# EAGLE schematic tx (EAGLE 9.6.2)
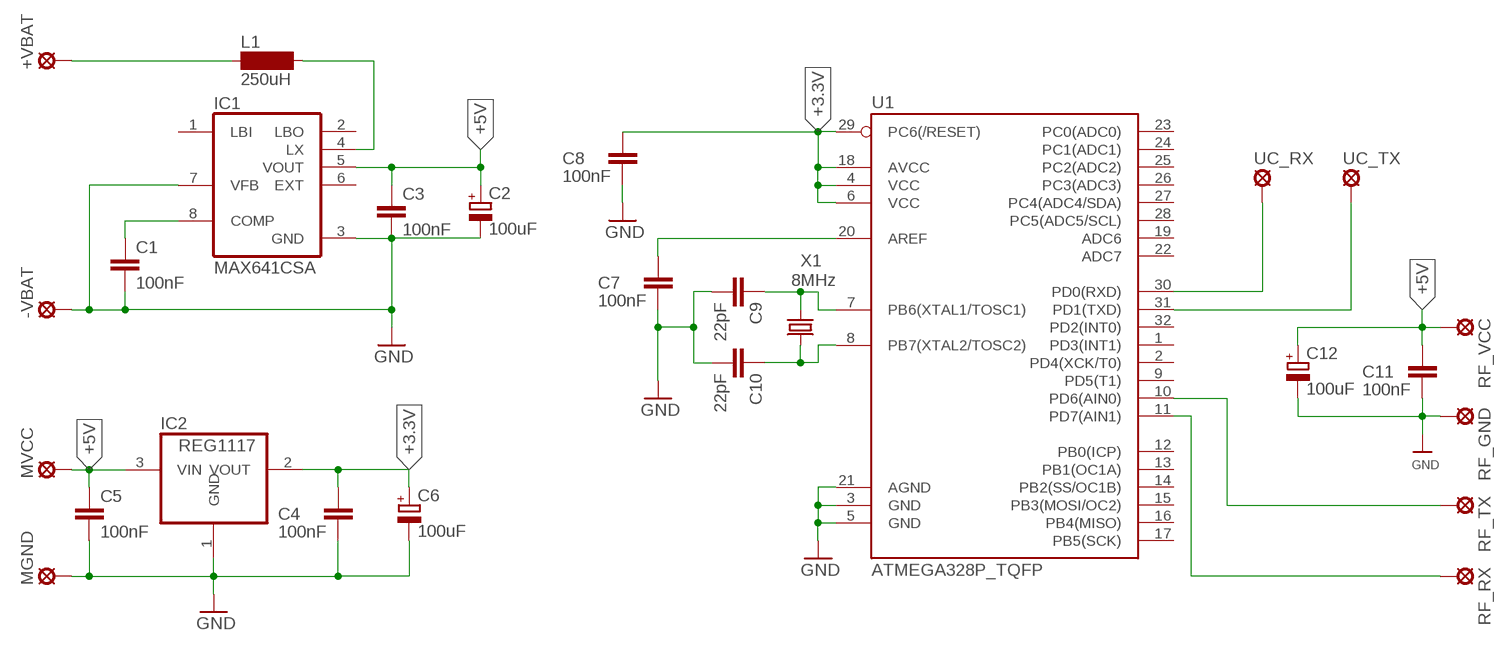
[diagram p0: schematic, sheet 1]

## Parts
+VBAT  SE14  [SE14]
-VBAT  SE14  [SE14]
C1  100nF  C-EUC1206  [C1206]
C2  100uF  CPOL-EU140CLH-0810  [140CLH-0810]
C3  100nF  C-EUC1206  [C1206]
C4  100nF  C-EUC1206  [C1206]
C5  100nF  C-EUC1206  [C1206]
C6  100uF  CPOL-EU140CLH-0810  [140CLH-0810]
C7  100nF  C-EUC1206  [C1206]
C8  100nF  C-EUC1206  [C1206]
C9  22pF  22PF-0603-50V-5%  [0603]
C10  22pF  22PF-0603-50V-5%  [0603]
C11  100nF  C-EUC1206  [C1206]
C12  100uF  CPOL-EU140CLH-0810  [140CLH-0810]
IC1  MAX641CSA  [SO08]
IC2  REG1117  [SOT223]
L1  250uH  MS50  [MS50]
MGND  SE14  [SE14]
MVCC  SE14  [SE14]
RF_GND  SE14  [SE14]
RF_RX  SE14  [SE14]
RF_TX  SE14  [SE14]
RF_VCC  SE14  [SE14]
U1  ATMEGA328P_TQFP  [TQFP32-08]
UC_RX  SE14  [SE14]
UC_TX  SE14  [SE14]
X1  8MHz  CSM-7X-DU  [CSM-7X-DU]

## Nets
+3.3V: C4.1 C6.+ C8.1 IC2.2(VOUT) U1.4(VCC) U1.6(VCC) U1.18(AVCC) U1.29(PC6(/RESET))
+5V: C2.+ C3.1 C5.1 C11.1 C12.+ IC1.5(VOUT) IC2.3(VIN) MVCC.MP RF_VCC.MP
GND: -VBAT.MP C1.2 C2.- C3.2 C4.2 C5.2 C6.- C7.2 C8.2 C9.2 C10.2 C11.2 C12.- IC1.3(GND) IC1.7(VFB) IC2.1(GND) MGND.MP RF_GND.MP U1.3(GND) U1.5(GND) U1.21(AGND)
N$1: IC1.4(LX) L1.2
N$2: C1.1 IC1.8(COMP)
N$3: C7.1 U1.20(AREF)
N$4: +VBAT.MP L1.1
N$5: RF_RX.MP U1.11(PD7(AIN1))
N$6: C9.1 U1.7(PB6(XTAL1/TOSC1)) X1.1
N$7: C10.1 U1.8(PB7(XTAL2/TOSC2)) X1.2
N$8: RF_TX.MP U1.10(PD6(AIN0))
N$9: U1.30(PD0(RXD)) UC_RX.MP
N$10: U1.31(PD1(TXD)) UC_TX.MP
Unconnected: IC1.1(LBI) IC1.2(LBO) IC1.6(EXT) U1.1(PD3(INT1)) U1.2(PD4(XCK/T0)) U1.9(PD5(T1)) U1.12(PB0(ICP)) U1.13(PB1(OC1A)) U1.14(PB2(SS/OC1B)) U1.15(PB3(MOSI/OC2)) U1.16(PB4(MISO)) U1.17(PB5(SCK)) U1.19(ADC6) U1.22(ADC7) U1.23(PC0(ADC0)) U1.24(PC1(ADC1)) U1.25(PC2(ADC2)) U1.26(PC3(ADC3)) U1.27(PC4(ADC4/SDA)) U1.28(PC5(ADC5/SCL)) U1.32(PD2(INT0))

## Library data of the parts
+VBAT -VBAT MGND MVCC RF_GND RF_RX RF_TX RF_VCC UC_RX UC_TX = solpad:SE14: SOLDER PAD E1553, drill 1,4mm, distributor Buerklin, 07F820
C1 C3-C5 C7 C8 C11 = rcl:C-EU: CAPACITOR, European symbol; SPICEPREFIX: C
C2 C6 C12 = rcl:CPOL-EU: POLARIZED CAPACITOR, European symbol; SPICEPREFIX: C
C9 C10 = SparkFun-Capacitors:22PF: 22pF ceramic capacitors A capacitor is a passive two-terminal electrical component used to store electrical energy temporarily in an electric field.; PROD_ID: CAP-07876
IC1 = maxim:MAX641CSA: Step-up SWITCHING REGULATOR CONTROLLER; OC_FARNELL: unknown; OC_NEWARK: unknown
IC2 = burr-brown:REG1117: 800mA and 1A Low Dropout (LDO) Positive Regulator 1.8V, 2.5V, 2.85V, 3.3V, 5V, and Adj; MPN: REG1117; OC_FARNELL: 1097566; OC_NEWARK: 14P6981
L1 = inductor-neosid:MS50: INDUCTOR SMD power inductor; OC_FARNELL: unknown; OC_NEWARK: unknown
U1 = SparkFun-IC-Microcontroller:ATMEGA328P_TQFP: Popular 328P in QFP Storefront component: ATmega328 - TQFP <https://www.sparkfun.com/products/13448> (COM-13448) Datasheet <http://www.sparkfun.com/datasheets/Components/SMD/ATMega328.pdf> SparkFun Products SparkFun RedBoard - Programmed with Arduino <https://www.sparkfun.com/products/12757> (DEV-12757) Arduino Pro Mini 328 - 5V/16MHz <https://www.sparkfun.com/products/11113> (DEV-11113) Arduino Pro Mini 328 - 3.3V/8MHz <https://www.sparkfun.com/products/11114> (DEV-11114) SparkFun OpenLog <https://www.sparkfun.com/products/13712> (DEV-13712) SparkFun MicroView - OLED Arduino Module <https://www.sparkfun.com/products/12923> (DEV-12923) SparkFun Digital Sandbox <https://www.sparkfun.com/products/12651> (DEV-12651) SparkFun PicoBoard <https://www.sparkfun.com/products/11888> (WIG-11888) Arduino Fio <https://www.sparkfun.com/products/10116> (DEV-10116) LilyPad Arduino 328 Main Board <https://www.sparkfun.com/products/13342> (DEV-13342) SparkFun RedStick <https://www.sparkfun.com/products/13741> (DEV-13741) LilyPad MP3 <https://www.sparkfun.com/products/11013> (DEV-11013) LilyPad Arduino SimpleSnap <https://www.sparkfun.com/products/10941> (DEV-10941) SparkFun Stepoko <https://www.sparkfun.com/products/13899> (ROB-13899) SparkFun Geiger Counter <https://www.sparkfun.com/products/11345> (SEN-11345) SparkFun EL Sequencer <https://www.sparkfun.com/products/12781> (COM-12781) Arduino Pro 328 - 5V/16MHz <https://www.sparkfun.com/products/10915> (DEV-10915) CryptoCape <https://www.sparkfun.com/products/12773> (DEV-12773) SparkFun IR Thermometer Evaluation Board - MLX90614 <https://www.sparkfun.com/products/10740> (SEN-10740) SparkFun RedBot Mainboard <https://www.sparkfun.com/products/12097> (ROB-12097) Arduino Pro 328 - 3.3V/8MHz <https://www.sparkfun.com/products/10914> (DEV-10914) SparkFun Block for Intel® Edison - Arduino <https://www.sparkfun.com/products/13036> (DEV-13036) SparkFun Simon Says - Surface Mount Soldering Kit <https://www.sparkfun.com/products/10935> (KIT-10935) SparkFun 7-Segment Serial Display - Red <https://www.sparkfun.com/products/11441> (COM-11441) SparkFun 7-Segment Serial Display - White <https://www.sparkfun.com/products/11629> (COM-11629) SparkFun 7-Segment Serial Display - Yellow <https://www.sparkfun.com/products/11443> (COM-11443) SparkFun 7-Segment Serial Display - Kelly Green <https://www.sparkfun.com/products/11440> (COM-11440) SparkFun 7-Segment Serial Display - Blue <https://www.sparkfun.com/products/11442> (COM-11442) SparkFun OpenSegment Serial Display - 20mm (Blue) <https://www.sparkfun.com/products/11647> (COM-11647) SparkFun OpenSegment Serial Display - 20mm (Green) <https://www.sparkfun.com/products/11646> (COM-11646) SparkFun OpenSegment Serial Display - 20mm (White) <https://www.sparkfun.com/products/11648> (COM-11648) SparkFun OpenSegment Serial Display - 20mm (Red) <https://www.sparkfun.com/products/11644> (COM-11644) SparkFun OpenSegment Serial Display - 20mm (Yellow) <https://www.sparkfun.com/products/11645> (COM-11645) SparkFun OpenSegment Shield <https://www.sparkfun.com/products/13190> (DEV-13190); PROD_ID: IC-09069
X1 = crystal:CSM-7X-DU: SMD CRYSTAL Source: www.ecsxtal.com .. Crystal 3.6864MHz CSM_7X_DU.PDF; OC_FARNELL: unknown; OC_NEWARK: unknown